# Altium schematic sheet Copy of MCU and CLK.SchDoc
size A; SheetNumber: 7; SheetTotal: 7
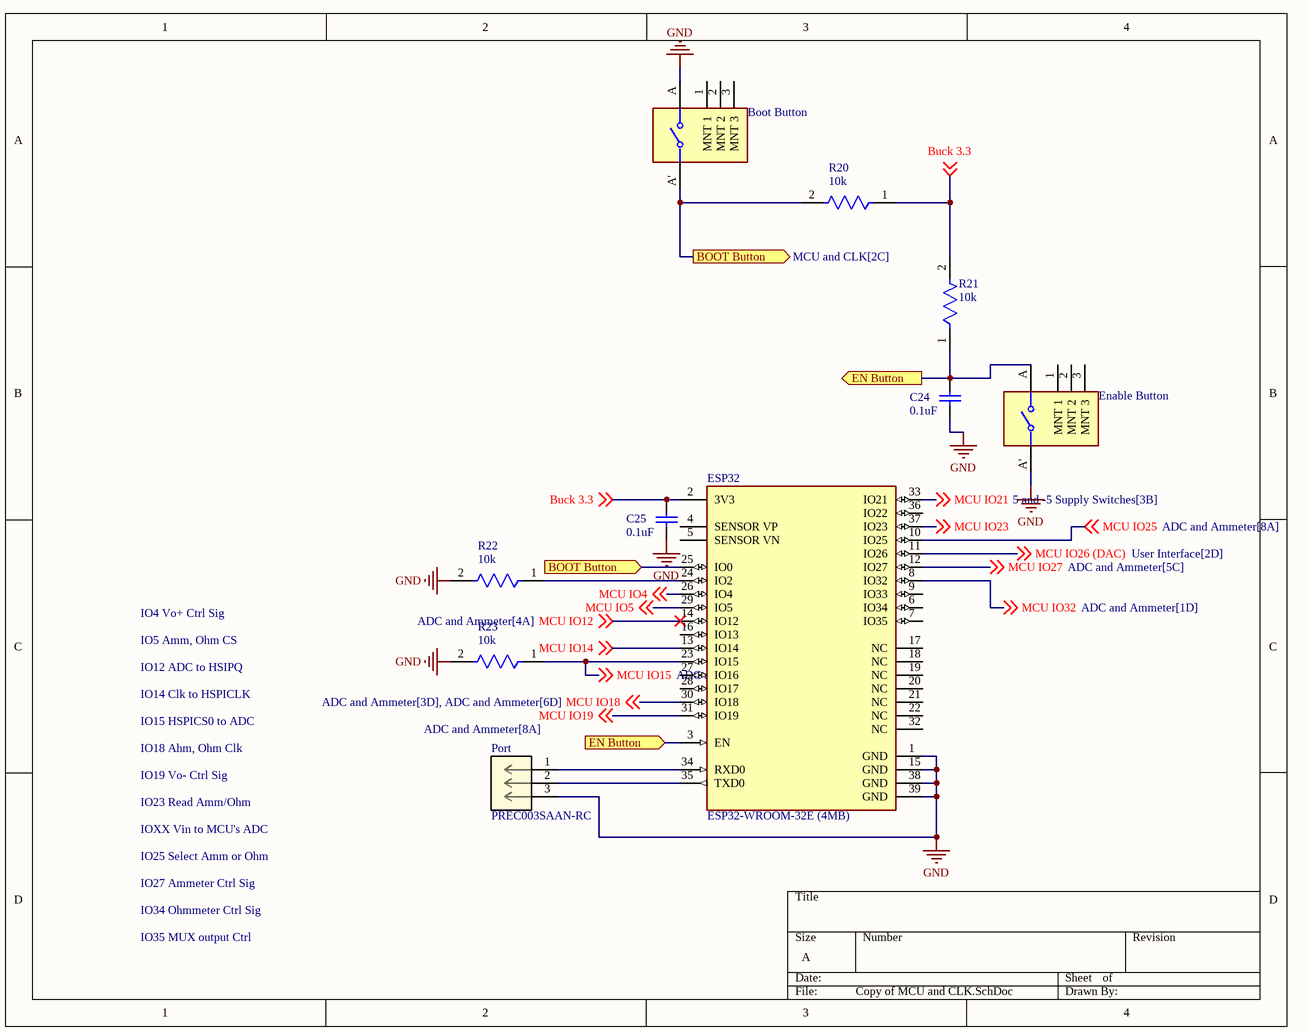
[diagram p0: Copy of MCU and CLK.SchDoc]

## Parts
Boot_Button  EVP-AKE31A  [FP-EVP-AKE31A-MFG]  (value not drawn)
C24  0.1uF  [CAPC2013X94X50LL20T25]
C25  0.1uF  [CAPC2013X94X50LL20T25]
Enable_Button  EVP-AKE31A  [FP-EVP-AKE31A-MFG]  (value not drawn)
ESP32  ESP32-WROOM-32E (4MB)  [FP-ESP32-WROOM-32E_4MB-MFG]
Port  PREC003SAAN-RC  [CONN_PREC003SAAN-RC_SUL]
R20  10k  [FP-RK73H1J-IPC_B]
R21  10k  [FP-RK73H1J-IPC_B]
R22  10k  [FP-RK73H1J-IPC_B]
R23  10k  [FP-RK73H1J-IPC_B]

## Ports
BOOT Button (in, see MCU and CLK[3A]), BOOT Button (out, see MCU and CLK[2C]), EN Button (in, see MCU and CLK[3B]), EN Button (out, see MCU and CLK[2C])

## Nets
GND: Boot_Button.A C24.1 C25.1 Enable_Button.A' ESP32.1(GND) ESP32.15(GND) ESP32.38(GND) ESP32.39(GND) Port.3 R22.2 R23.2
BOOT Button: Boot_Button.A' ESP32.25(IO0) R20.2 ; port BOOT Button
Buck 3.3: C25.2 ESP32.2(3V3) R20.1 R21.2 ; off-sheet Buck 3.3
EN Button: C24.2 Enable_Button.A ESP32.3(EN) R21.1 ; port EN Button
MCU IO4: ESP32.26(IO4) ; off-sheet MCU IO4
MCU IO5: ESP32.29(IO5) ; off-sheet MCU IO5
MCU IO12: ESP32.14(IO12) ; off-sheet MCU IO12
MCU IO14: ESP32.13(IO14) ; off-sheet MCU IO14
MCU IO15: ESP32.23(IO15) R23.1 ; off-sheet MCU IO15
MCU IO18: ESP32.30(IO18) ; off-sheet MCU IO18
MCU IO19: ESP32.31(IO19) ; off-sheet MCU IO19
MCU IO21: ESP32.33(IO21) ; off-sheet MCU IO21
MCU IO23: ESP32.37(IO23) ; off-sheet MCU IO23
MCU IO25: ESP32.10(IO25) ; off-sheet MCU IO25
MCU IO26 (DAC): ESP32.11(IO26) ; off-sheet MCU IO26 (DAC)
MCU IO27: ESP32.12(IO27) ; off-sheet MCU IO27
MCU IO32: ESP32.8(IO32) ; off-sheet MCU IO32
NetESP32_24: ESP32.24(IO2) R22.1
NetESP32_34: ESP32.34(RXD0) Port.1
NetESP32_35: ESP32.35(TXD0) Port.2

Not connected (* = marked no-connect by the designer): Boot_Button 1(MNT_1) 2(MNT_2) 3(MNT_3); Enable_Button 1(MNT_1) 2(MNT_2) 3(MNT_3); ESP32 4(SENSOR_VP) 5(SENSOR_VN) 6(IO34) 7(IO35) 9(IO33) 16(IO13) 17(NC) 18(NC) 19(NC) 20(NC) 21(NC) 22(NC) 27(IO16) 28(IO17) 32(NC) 36(IO22)

## Notes on the sheet
- IO4 Vo+ Ctrl Sig
- IO5 Amm, Ohm CS
- IO12 ADC to HSIPQ
- IO14 Clk to HSPICLK
- IO15 HSPICS0 to ADC
- IO19 Vo- Ctrl Sig
- IO18 Ahm, Ohm Clk
- IOXX Vin to MCU's ADC
- IO23 Read Amm/Ohm
- IO27 Ammeter Ctrl Sig
- IO34 Ohmmeter Ctrl Sig
- IO25 Select Amm or Ohm
- IO35 MUX output Ctrl

## Library data of the parts
Boot_Button Enable_Button = CMP-05618-000005-1: 3.8MM X 1.9MM / 1.6N / 0.12MM ST; Manufacturer: Panasonic; Electromechanical Life: 500000Cycles; Contact Resistance: 100mΩ; Contact Current Rating: 20mA; Throw Configuration: SPST-NO; Voltage Rating Dc: 15V; Manufacturer Part Number: EVP-AKE31A; Temperature Range High: +85°C; Mount: Surface Mount; Mouser Description: Switch Tactile N.O. SPST Rectangular Button Gull Wing 0.02A 15VDC 500000Cycles 1.6N SMD T/R; Digikey Description: 3.8MM X 1.9MM / 1.6N / 0.12MM ST; ComponentLink2URL: https://www3.panasonic.biz/ac/e_download/control/switch/light-touch/catalog/sw_lt_eng_3819s_side.pdf?f_cd=402908&via=ok; RoHS: TRUE; Temperature: -40°C to +85°C; Category: Switch; Device Class L3: Tactile Switches; Automotive: No; Lead Free: Yes; ComponentLink2Description: Datasheet; Temperature Range Low: -40°C; Octopart: https://octopart.com/evp-ake31a-panasonic-84742583; Operating Force: 1.6N; Package: 0; Device Class L2: Switches; Height: 1.68mm; Device Class L1: Electromechanical
C24 C25 = CMP-2007-04368-1: Part Number: 08055C104JAT4A; Manufacturer: AVX Interconnect / Elco
ESP32 = CMP-194065-000026-1: RX TXRX MOD WIFI TRACE ANT SMD
Port = PREC003SAAN-RC: No Description Available; Mfr_Name: Sullins; RefDes: RefDes; Type: Type
R20-R23 = CMP-2000-01751-2: 10kΩ ±1% 0.1W Chip Resistor 0603 Thick Film AEC-Q200 Qualified; Power Rating: 100mW; Temperature Coefficient: 100ppm/°C; Resistance: 10kR; Voltage Rating: 50V; Construction: Rectangular; Max Operating Temperature: 155°C; Resistor Type: Thick Film; Case/Package: 0603; Military Standard: MIL-R-55342F; Depth: 0.8mm; Termination: SMD/SMT; Min Operating Temperature: -55°C; RoHS Compliant: Yes; Width: 0.8mm; Length: 1.6mm; Height: 0.45mm; Case Code (Metric): 1608; Package Quantity: 10000; Lead Free: Lead Free; Series: RK73H; Packaging: Tape and Reel; Case Code (Imperial): 0603; Tolerance: 1%